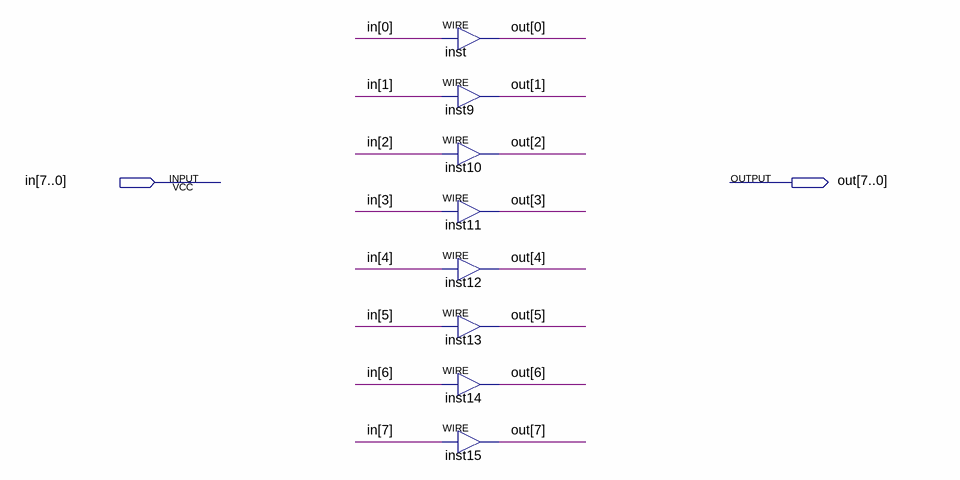
[diagram p0: schematic sheet]
// Quartus schematic buf8.bdf as structural Verilog: 8 symbols, 2 pins
module buf8 (
  input  [7:0] in,
  output [7:0] out
);

  assign out[0] = in[0];  // WIRE inst
  assign out[1] = in[1];  // WIRE inst9
  assign out[2] = in[2];  // WIRE inst10
  assign out[3] = in[3];  // WIRE inst11
  assign out[4] = in[4];  // WIRE inst12
  assign out[5] = in[5];  // WIRE inst13
  assign out[6] = in[6];  // WIRE inst14
  assign out[7] = in[7];  // WIRE inst15
endmodule
